# Altium schematic sheet LCDDisplay.SchDoc
size A4
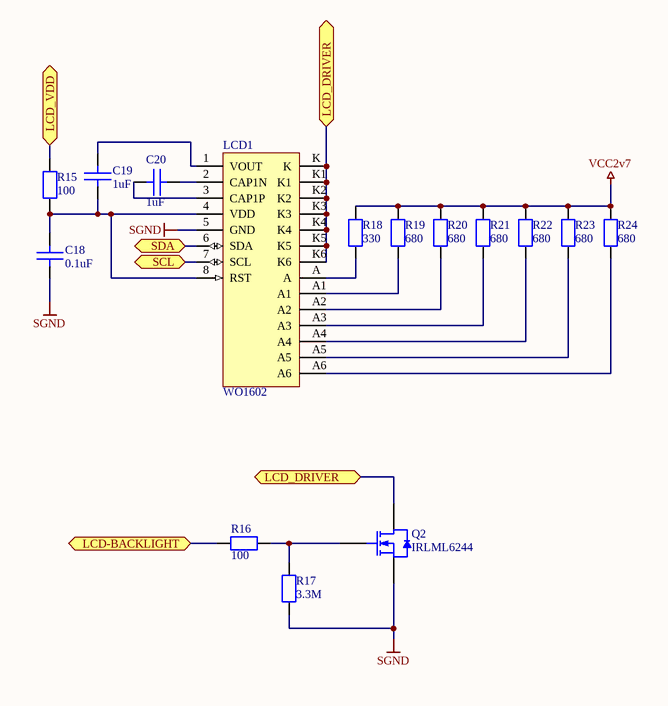
[diagram p0: LCDDisplay.SchDoc]

## Parts
C18  value 0.1uF  [C0805]  (hidden comment: C0.1uF-50V)
C19  value 1uF  [C0805]  (hidden comment: C1uF-50V)
C20  value 1uF  [C0805]  (hidden comment: C1uF-50V)
LCD1  WO1602  [WO1602I]
Q2  IRLML6244  [SOT23_N]
R15  value 100  [R0805]  (hidden comment: R100-5%)
R16  value 100  [R0805]  (hidden comment: R100-5%)
R17  value 3.3M  [R0805]  (hidden comment: R3.3M-5%)
R18  value 330  [R1206]  (hidden comment: R330-5%)
R19  value 680  [R1206]  (hidden comment: R680-5%)
R20  value 680  [R1206]  (hidden comment: R680-5%)
R21  value 680  [R1206]  (hidden comment: R680-5%)
R22  value 680  [R1206]  (hidden comment: R680-5%)
R23  value 680  [R1206]  (hidden comment: R680-5%)
R24  value 680  [R1206]  (hidden comment: R680-5%)

## Ports
LCD-BACKLIGHT, LCD_DRIVER, LCD_VDD, SCL, SDA

## Nets
SGND: C18.1 LCD1.5(GND) Q2.2(S) R17.2
VCC2v7: R18.2 R19.2 R20.2 R21.2 R22.2 R23.1 R24.2
LCD-BACKLIGHT: R16.1 ; port LCD-BACKLIGHT
LCD_DRIVER: LCD1.K LCD1.K1 LCD1.K2 LCD1.K3 LCD1.K4 LCD1.K5 LCD1.K6 Q2.3(D) ; port LCD_DRIVER
LCD_VDD: R15.2 ; port LCD_VDD
SCL: LCD1.7(SCL) ; port SCL
SDA: LCD1.6(SDA) ; port SDA
NetC18_2: C18.2 C19.2 LCD1.4(VDD) LCD1.8(RST) R15.1
NetC19_1: C19.1 LCD1.1(VOUT)
NetC20_1: C20.1 LCD1.2(CAP1N)
NetC20_2: C20.2 LCD1.3(CAP1P)
NetLCD1_A: LCD1.A R18.1
NetLCD1_A1: LCD1.A1 R19.1
NetLCD1_A2: LCD1.A2 R20.1
NetLCD1_A3: LCD1.A3 R21.1
NetLCD1_A4: LCD1.A4 R22.1
NetLCD1_A5: LCD1.A5 R23.2
NetLCD1_A6: LCD1.A6 R24.1
NetQ2_1: Q2.1(G) R16.2 R17.1

## Library data of the parts
C18 = C0.1uF-50V: Type: Конденсатор керамический; Voltage: 50V; Name: C0.1uF-50V
C19 C20 = C1uF-50V: Type: Конденсатор керамический; Voltage: 50V; Name: C1uF-50V
LCD1 = WO1602: LCD COG display 16x02; Name: WO1602; Type: LCD COG дисплей
Q2 = IRLML6244: N-Channel Power MOSFET; Type: MOSFET N-канал; Id: 6.3A; Vgs: 0.5-11V; Vds: 20V; Name: IRLML6244
R15 R16 = R100-5%: R-100-5%; Precision: 5%; Type: Резистор; Name: R100-5%
R17 = R3.3M-5%: Precision: 5%; Type: Резистор; Name: R3.3M-5%
R18 = R330-5%: R-330-5%; Precision: 5%; Type: Резистор; Name: R330-5%
R19-R24 = R680-5%: R-680-5%; Precision: 5%; Type: Резистор; Name: R680-5%